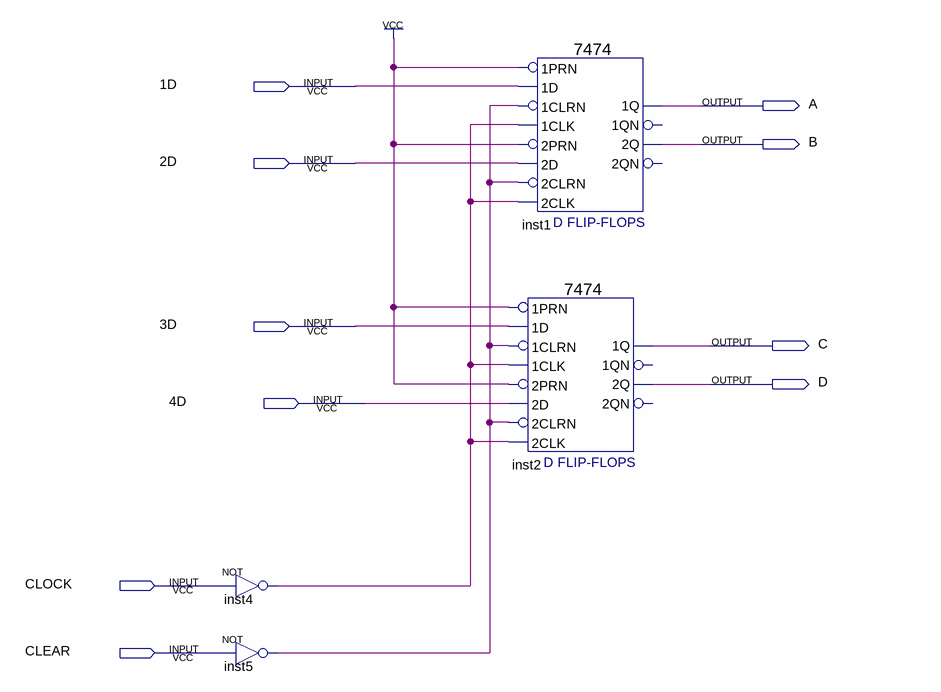
[diagram p0: schematic sheet]
// Quartus schematic pipoRegister.bdf as structural Verilog: 4 symbols, 10 pins
module pipoRegister (
  input  \1D ,
  input  \2D ,
  input  \3D ,
  input  \4D ,
  input  CLOCK,
  input  CLEAR,
  output A,
  output B,
  output C,
  output D
);

  wire inst4_out, inst5_out;

  not inst4 (inst4_out, CLOCK);
  not inst5 (inst5_out, CLEAR);
  \7474  inst1 (
    .\2D (\2D ), .\2PRN (1'b1), .\1CLK (inst4_out), .\1D (\1D ), .\1PRN (1'b1), .\2CLK (inst4_out),
    .\2CLRN (inst5_out), .\1CLRN (inst5_out), .\2Q (B), .\1Q (A));  // open: 1QN, 2QN
  \7474  inst2 (
    .\2D (\4D ), .\2PRN (1'b1), .\1CLK (inst4_out), .\1D (\3D ), .\1PRN (1'b1), .\2CLK (inst4_out),
    .\2CLRN (inst5_out), .\1CLRN (inst5_out), .\2Q (D), .\1Q (C));  // open: 1QN, 2QN
endmodule
